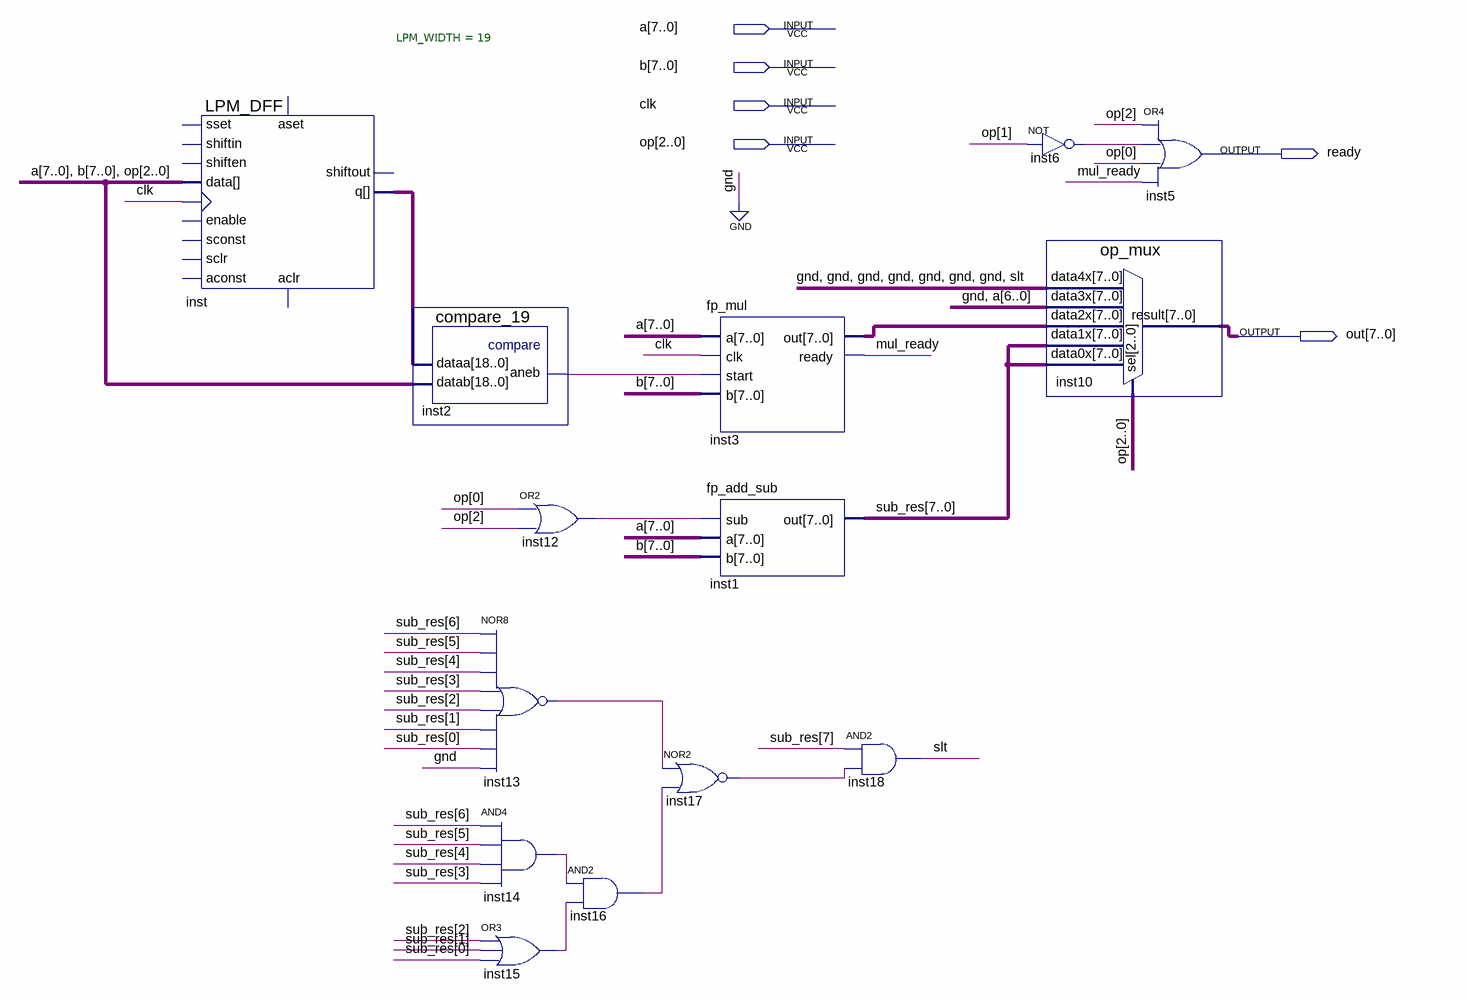
[diagram p0: schematic sheet]
// Quartus schematic FPU.bdf as structural Verilog: 14 symbols, 6 pins
module FPU (
  input  [7:0] a,
  input  [7:0] b,
  input  clk,
  input  [2:0] op,
  output ready,
  output [7:0] out
);

  wire inst2_aneb, inst6_out, inst12_out, inst13_out, inst14_out, inst15_out, inst16_out, inst17_out,
       mul_ready, slt;
  wire [7:0] inst3_out, sub_res;
  wire [18:0] inst_q;

  LPM_DFF #(.LPM_WIDTH(19)) inst (
    .clock(clk), .data({a, b, op}), .q(inst_q));  // open: shiftin, shiften, enable, aconst, sclr, sconst, sset, aset, aclr, shiftout
  compare_19 inst2 (.dataa(inst_q), .datab({a, b, op}), .aneb(inst2_aneb));
  or inst12 (inst12_out, op[0], op[2]);
  nor inst13 (inst13_out, sub_res[6], sub_res[5], sub_res[4], sub_res[3], sub_res[2], sub_res[1], sub_res[0], 1'b0);
  and inst14 (inst14_out, sub_res[6], sub_res[5], sub_res[4], sub_res[3]);
  or inst15 (inst15_out, sub_res[2], sub_res[1], sub_res[0]);
  and inst16 (inst16_out, inst14_out, inst15_out);
  nor inst17 (inst17_out, inst13_out, inst16_out);
  fp_mul inst3 (.a(a), .clk(clk), .start(inst2_aneb), .b(b), .out(inst3_out), .ready(mul_ready));
  fp_add_sub inst1 (.sub(inst12_out), .a(a), .b(b), .out(sub_res));
  and inst18 (slt, sub_res[7], inst17_out);
  not inst6 (inst6_out, op[1]);
  op_mux inst10 (
    .data4x({{7{1'b0}}, slt}), .data3x({1'b0, a[6:0]}), .data2x(inst3_out), .data1x(sub_res),
    .data0x(sub_res), .sel(op), .result(out));
  or inst5 (ready, op[2], inst6_out, op[0], mul_ready);
endmodule
